# EAGLE schematic Initial layout (EAGLE 8.6.0)
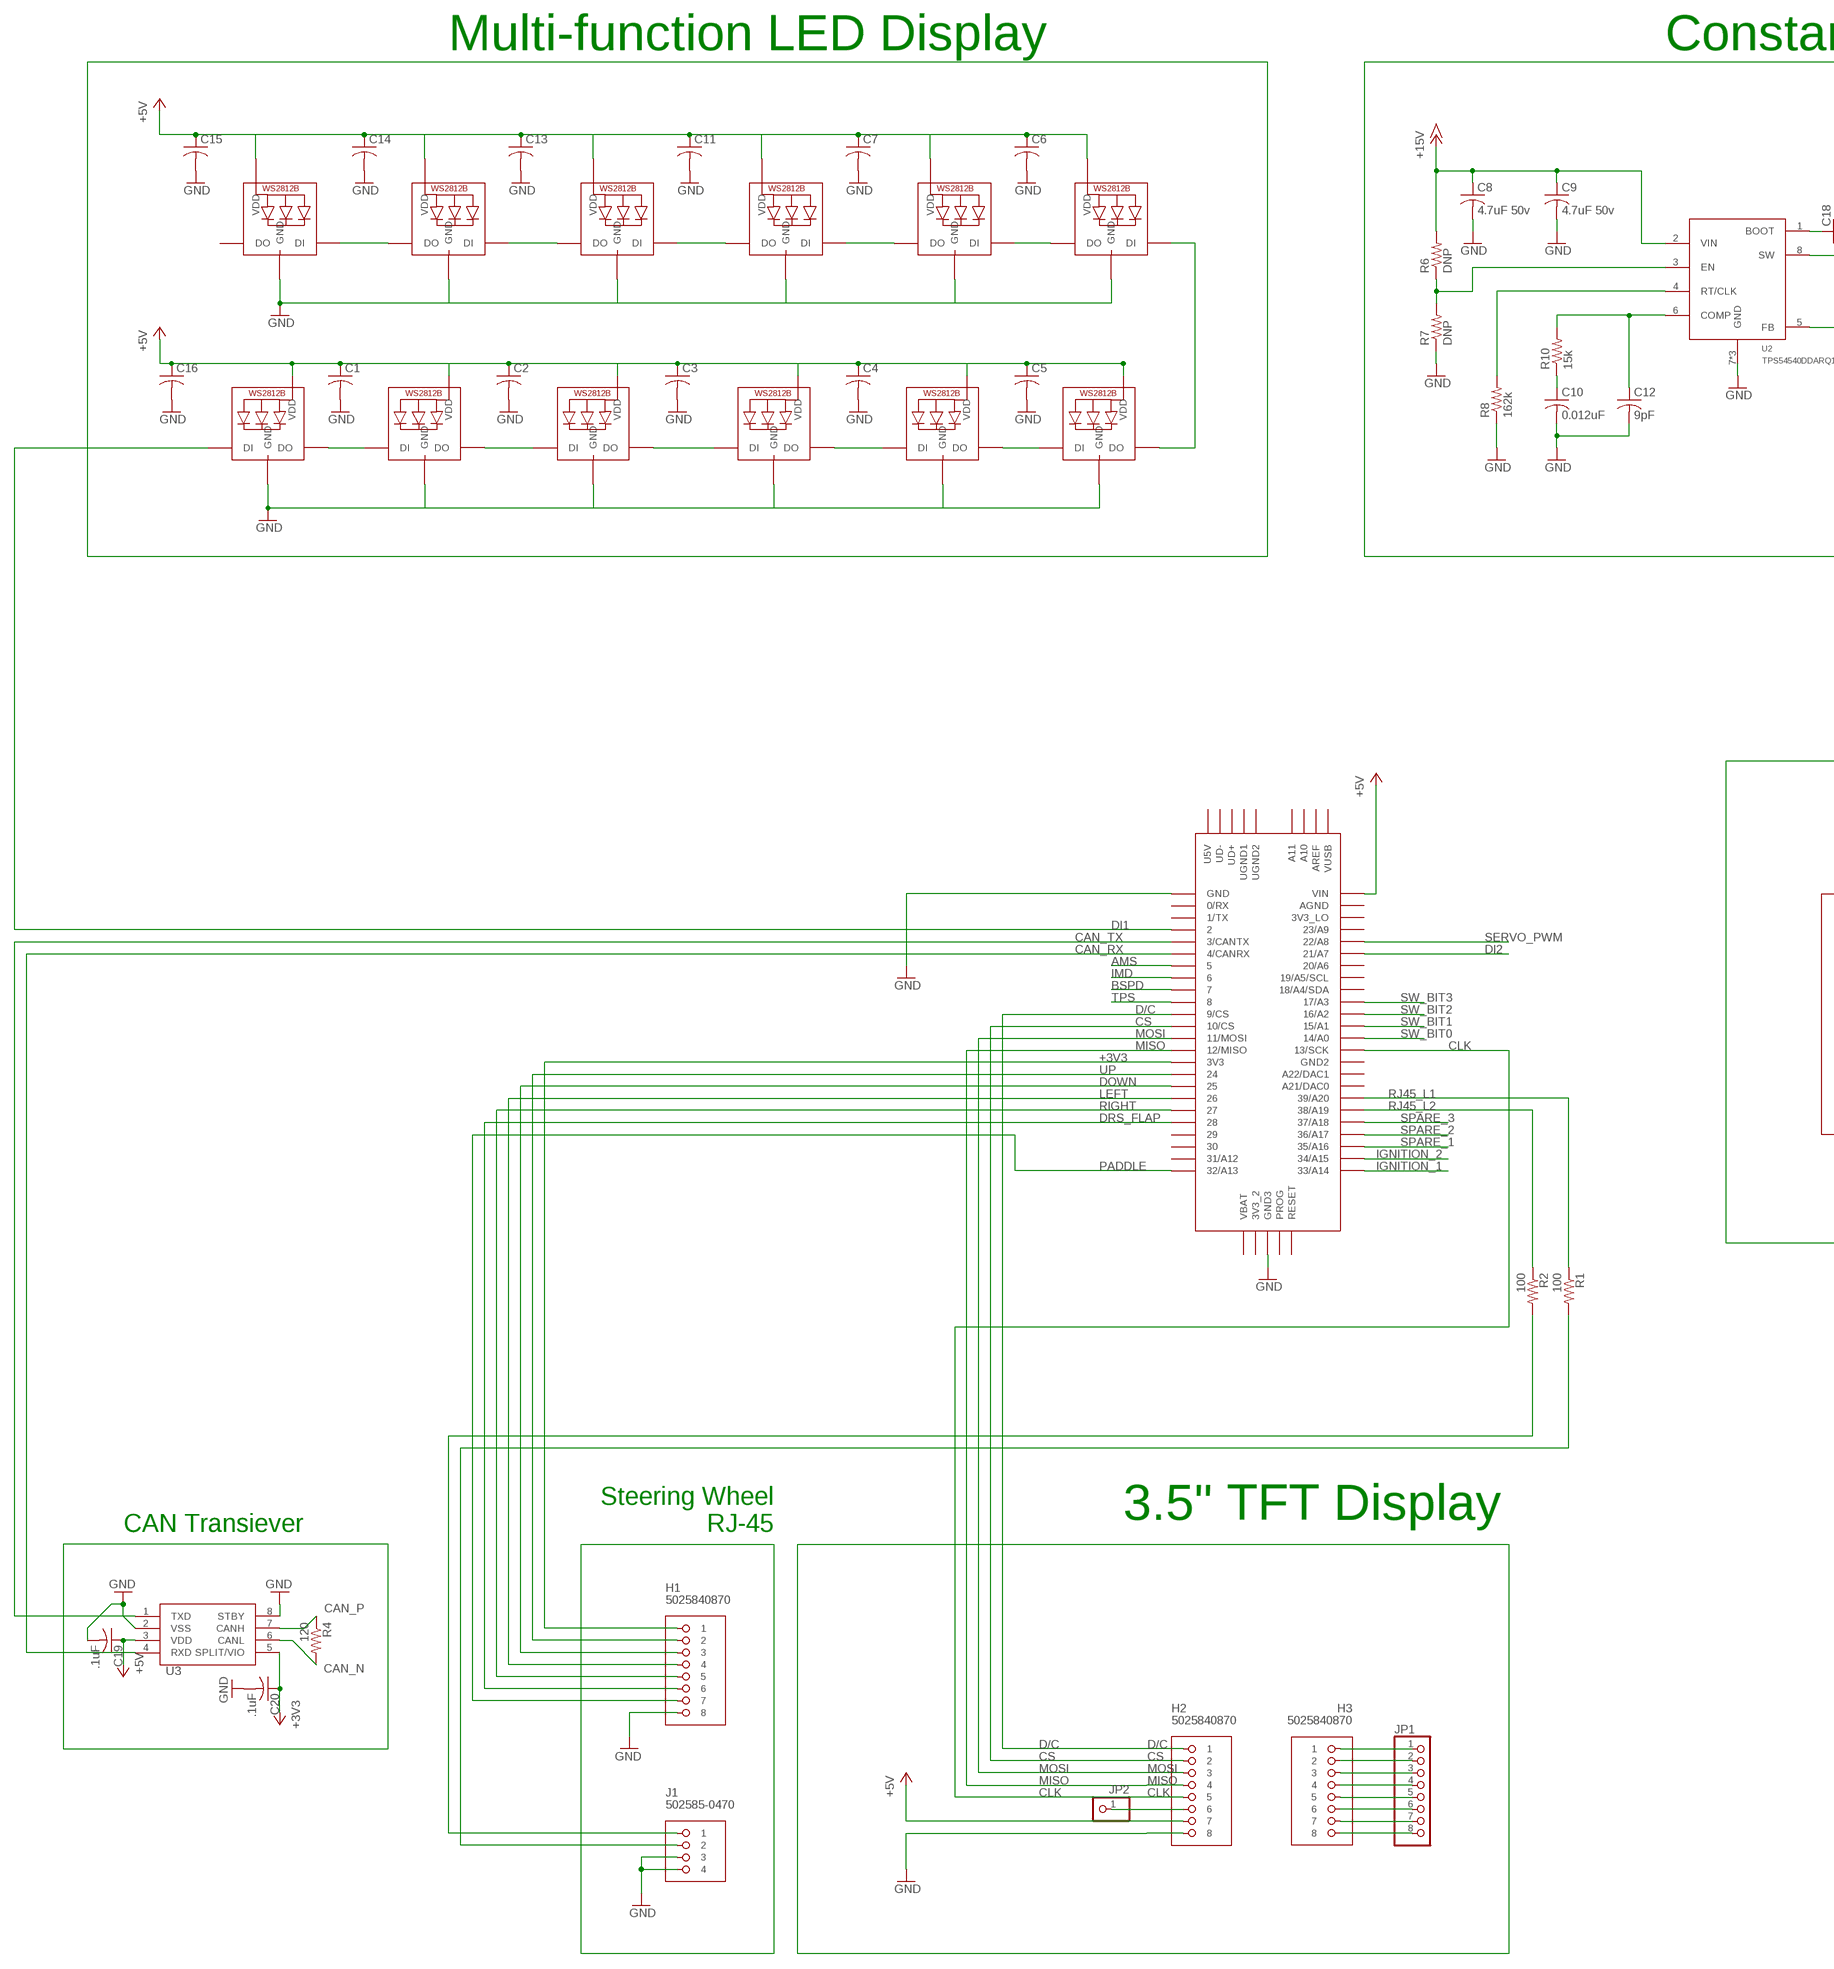
[diagram p0: schematic, sheet 1, part 1 of 2]
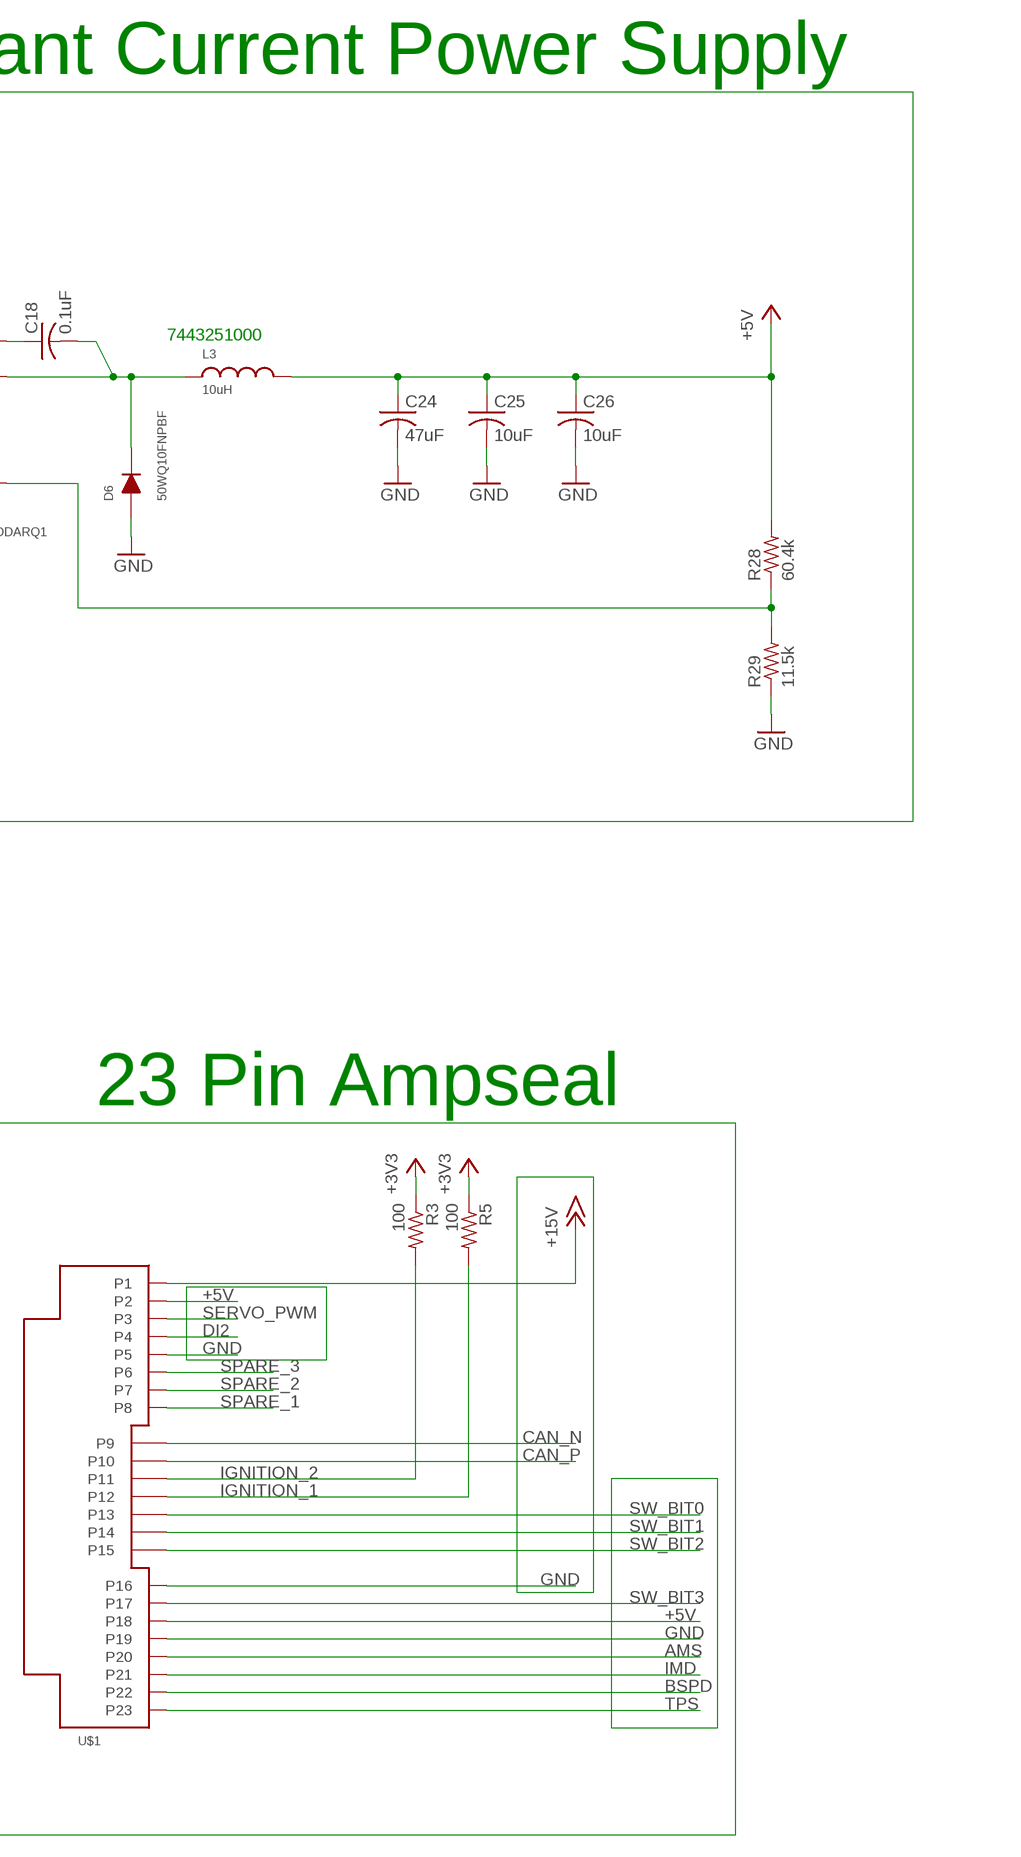
[diagram p1: schematic, sheet 1, part 2 of 2]

## Parts
C1  C-USC0402  [C0402]
C2  C-USC0402  [C0402]
C3  C-USC0402  [C0402]
C4  C-USC0402  [C0402]
C5  C-USC0402  [C0402]
C6  C-USC0402  [C0402]
C7  C-USC0402  [C0402]
C8  4.7uF 50v  C-USC1206  [C1206]
C9  4.7uF 50v  C-USC1206  [C1206]
C10  0.012uF  C-USC0603K  [C0603K]
C11  C-USC0402  [C0402]
C12  9pF  C-USC0603K  [C0603K]
C13  C-USC0402  [C0402]
C14  C-USC0402  [C0402]
C15  C-USC0402  [C0402]
C16  C-USC0402  [C0402]
C18  0.1uF  C-USC0603K  [C0603K]
C19  .1uF  C-USC0805  [C0805]
C20  .1uF  C-USC0805  [C0805]
C24  47uF  C-USC1206  [C1206]
C25  10uF  C-USC0603K  [C0603K]
C26  10uF  C-USC0603K  [C0603K]
D6  50WQ10FNPBF  VISHAY-50WQ10FNPBF  [DPAK]
H1  5025840870  MOLEX_CLICKMATE-8-VERTICAL  [MOLEX-CLIKMATE-8-VERTICAL-HEADER]
H2  5025840870  MOLEX_CLICKMATE-8-VERTICAL  [MOLEX-CLIKMATE-8-VERTICAL-HEADER]
H3  5025840870  MOLEX_CLICKMATE-8-VERTICAL  [MOLEX-CLIKMATE-8-VERTICAL-HEADER]
J1  502585-0470  MOLEX_CLICKMATE-4-R/A  [MOLEX-CLIKMATE-4-R/A]
JP1  PINHD-1X8  [1X08]
JP2  PINHD-1X1  [1X01]
L3  10uH  WURTH-744325XXXX  [WURTH-744325XXXX]
LED1  WS2812B5050  [WS2812B]
LED2  WS2812B5050  [WS2812B]
LED3  WS2812B5050  [WS2812B]
LED4  WS2812B5050  [WS2812B]
LED5  WS2812B5050  [WS2812B]
LED6  WS2812B5050  [WS2812B]
LED7  WS2812B5050  [WS2812B]
LED8  WS2812B5050  [WS2812B]
LED9  WS2812B5050  [WS2812B]
LED10  WS2812B5050  [WS2812B]
LED11  WS2812B5050  [WS2812B]
LED12  WS2812B5050  [WS2812B]
R1  100  R-US_R0805  [R0805]
R2  100  R-US_R0805  [R0805]
R3  100  R-US_R0805  [R0805]
R4  120  R-US_R0805  [R0805]
R5  100  R-US_R0805  [R0805]
R6  DNP  R-US_R0603  [R0603]
R7  DNP  R-US_R0603  [R0603]
R8  162k  R-US_R0603  [R0603]
R10  15k  R-US_R0603  [R0603]
R28  60.4k  R-US_R0603  [R0603]
R29  11.5k  R-US_R0603  [R0603]
U2  TPS54540DDARQ1  TPS54540  [TPS54540]
U3  MCP256X-SOIC  [SOIC8-N_MC]
U$1  TE-776200-1  [776200-1]
U$2  TEENSY_3.5/3.6  [TEENSY_3.5/3.6]

## Nets
5VREG_EN: R6.1 R7.2 U2.3(EN)
+1V2: R3.1 R5.1 ; supply symbol labelled +3V3
+3V3: C20.1 H1.1 U3.5(SPLIT/VIO) U$2.3V3
+5V: C1.1 C2.1 C3.1 C4.1 C5.1 C6.1 C7.1 C11.1 C13.1 C14.1 C15.1 C16.1 C19.1 C24.1 C25.1 C26.1 H2.7 L3.P$2 LED1.1-VDD(VDD) LED2.1-VDD(VDD) LED3.1-VDD(VDD) LED4.1-VDD(VDD) LED5.1-VDD(VDD) LED6.1-VDD(VDD) LED7.1-VDD(VDD) LED8.1-VDD(VDD) LED9.1-VDD(VDD) LED10.1-VDD(VDD) LED11.1-VDD(VDD) LED12.1-VDD(VDD) R28.2 U3.3(VDD) U$1.P$2(P2) U$1.P$18(P18) U$2.VIN
+15V: C8.1 C9.1 R6.2 U2.2(VIN) U$1.P$1(P1)
AMS: U$1.P$20(P20) U$2.5
BOOT_5V: C18.1 U2.1(BOOT)
BSPD: U$1.P$22(P22) U$2.7
CAN_N: R4.2 U3.6(CANL) U$1.P$9(P9)
CAN_P: R4.1 U3.7(CANH) U$1.P$10(P10)
CAN_RX: U3.4(RXD) U$2.4/CANRX
CAN_TX: U3.1(TXD) U$2.3/CANTX
CLK: H2.5 U$2.13/SCK
COMP_5V: C12.1 R10.2 U2.6(COMP)
CS: H2.2 U$2.10/CS
D/C: H2.1 U$2.9/CS
DI1: LED1.4-DIN(DI) U$2.2
DI2: U$1.P$4(P4) U$2.21/A7
DOWN: H1.3 U$2.25
DRS_FLAP: H1.6 U$2.28
FB_5V: R28.1 R29.2 U2.5(FB)
GND: C1.2 C2.2 C3.2 C4.2 C5.2 C6.2 C7.2 C8.2 C9.2 C10.2 C11.2 C12.2 C13.2 C14.2 C15.2 C16.2 C19.2 C20.2 C24.2 C25.2 C26.2 D6.1(ANODE) D6.3(ANODE) H1.8 H2.8 J1.3 J1.4 LED1.3-GND(GND) LED3.3-GND(GND) LED4.3-GND(GND) LED5.3-GND(GND) LED6.3-GND(GND) LED7.3-GND(GND) LED8.3-GND(GND) LED9.3-GND(GND) LED10.3-GND(GND) LED11.3-GND(GND) LED12.3-GND(GND) R7.1 R8.1 R29.1 U2.7(GND) U2.PAD1(GND) U2.PAD(GND) U3.2(VSS) U3.8(STBY) U$1.P$5(P5) U$1.P$16(P16) U$1.P$19(P19) U$2.GND U$2.GND3
IGNITION_1: R5.2 U$1.P$12(P12) U$2.33/A14
IGNITION_2: R3.2 U$1.P$11(P11) U$2.34/A15
IMD: U$1.P$21(P21) U$2.6
LEFT: H1.4 U$2.26
MISO: H2.4 U$2.12/MISO
MOSI: H2.3 U$2.11/MOSI
N$1: LED2.3-GND(GND)
N$2: LED1.2-DOUT(DO) LED2.4-DIN(DI)
N$3: H3.1 JP1.1
N$4: LED2.2-DOUT(DO) LED3.4-DIN(DI)
N$5: LED3.2-DOUT(DO) LED4.4-DIN(DI)
N$6: LED4.2-DOUT(DO) LED5.4-DIN(DI)
N$7: LED5.2-DOUT(DO) LED6.4-DIN(DI)
N$8: LED6.2-DOUT(DO) LED7.4-DIN(DI)
N$13: H3.2 JP1.2
N$15: H3.3 JP1.3
N$16: H3.4 JP1.4
N$17: H3.5 JP1.5
N$18: H3.6 JP1.6
N$19: H3.7 JP1.7
N$26: H3.8 JP1.8
N$27: H2.6 JP2.1
N$29: C10.1 R10.1
N$34: J1.1 R2.2
N$35: J1.2 R1.2
N$36: LED7.2-DOUT(DO) LED8.4-DIN(DI)
N$37: LED8.2-DOUT(DO) LED9.4-DIN(DI)
N$38: LED9.2-DOUT(DO) LED10.4-DIN(DI)
N$39: LED10.2-DOUT(DO) LED11.4-DIN(DI)
N$40: LED11.2-DOUT(DO) LED12.4-DIN(DI)
PADDLE: H1.7 U$2.32/A13
RIGHT: H1.5 U$2.27
RJ45_L1: R1.1 U$2.39/A20
RJ45_L2: R2.1 U$2.38/A19
RT_5V: R8.2 U2.4(RT/CLK)
SERVO_PWM: U$1.P$3(P3) U$2.22/A8
SPARE_1: U$1.P$8(P8) U$2.35/A16
SPARE_2: U$1.P$7(P7) U$2.36/A17
SPARE_3: U$1.P$6(P6) U$2.37/A18
SW_5V: C18.2 D6.2(CATHODE) L3.P$1 U2.8(SW)
SW_BIT0: U$1.P$13(P13) U$2.14/A0
SW_BIT1: U$1.P$14(P14) U$2.15/A1
SW_BIT2: U$1.P$15(P15) U$2.16/A2
SW_BIT3: U$1.P$17(P17) U$2.17/A3
TPS: U$1.P$23(P23) U$2.8
UP: H1.2 U$2.24
Unconnected: LED12.2-DOUT(DO) U$2.0/RX U$2.1/TX U$2.3V3_2 U$2.3V3_LO U$2.18/A4/SDA U$2.19/A5/SCL U$2.20/A6 U$2.21/DAC0(A21/DAC0) U$2.23/A9 U$2.29 U$2.30 U$2.31/A12 U$2.A10 U$2.A11 U$2.A22/DAC1 U$2.AGND U$2.AREF U$2.GND2 U$2.PROG U$2.RESET U$2.U5V U$2.UD+ U$2.UD- U$2.UGND1 U$2.UGND2 U$2.VBAT U$2.VUSB

## Notes on the sheet
- Multi-function LED Display | Constant Current Power Supply
- 7443251000
- 23 Pin Ampseal
- 3.5" TFT Display
- CAN Transiever
- Steering Wheel
          RJ-45

## Library data of the parts
C1-C7 C11 C13-C16 C19 C20 = rcl:C-US: CAPACITOR, American symbol
C8 C9 = rcl:C-US: CAPACITOR, American symbol; PARTNO: GRM31CR71H475KA12L
C10 = rcl:C-US: CAPACITOR, American symbol; PARTNO: GRM188R71H123KA01D
C12 = rcl:C-US: CAPACITOR, American symbol; PARTNO: GRM1885C1H9R0DA01D
C18 = rcl:C-US: CAPACITOR, American symbol; PARTNO: GRM188R71E104KA01D
C24 = rcl:C-US: CAPACITOR, American symbol; PARTNO: GRM31CR61A476ME15L
C25 C26 = rcl:C-US: CAPACITOR, American symbol; PARTNO: GRM188R61A106KE69D
D6 = FormE:VISHAY-50WQ10FNPBF; PARTNO: VS-50WQ10FNPBF
H1-H3 = FormE:MOLEX_CLICKMATE-8-VERTICAL: 505405-0860
J1 = FormE:MOLEX_CLICKMATE-4-R/A
JP1 = pinhead:PINHD-1X8: PIN HEADER
JP2 = pinhead:PINHD-1X1: PIN HEADER
L3 = FormE:WURTH-744325XXXX; PARTNO: 7443251000
LED1-LED12 = adafruit:WS2812B
R1-R5 = rcl:R-US_: RESISTOR, American symbol
R6 R7 = rcl:R-US_: RESISTOR, American symbol; PARTNO: *
R8 = rcl:R-US_: RESISTOR, American symbol; PARTNO: ERJ-3EKF1623V
R10 = rcl:R-US_: RESISTOR, American symbol; PARTNO: ERJ-3EKF1502V
R28 = rcl:R-US_: RESISTOR, American symbol; PARTNO: ERJ-3EKF6042V
R29 = rcl:R-US_: RESISTOR, American symbol; PARTNO: ERJ-3EKF1152V
U2 = FormE:TPS54540; PARTNO: TPS54540DDAR
U3 = FormE:MCP256X: MCP2561/2 CAN Transceiver Microchip High-Speed CAN Transceiver Datasheet <http://ww1.microchip.com/downloads/en/DeviceDoc/20005167C.pdf>
U$1 = FormE:TE-776200-1
U$2 = Teensy356:TEENSY_3.5/3.6